# EAGLE schematic Transmitter (EAGLE 7.6.0)
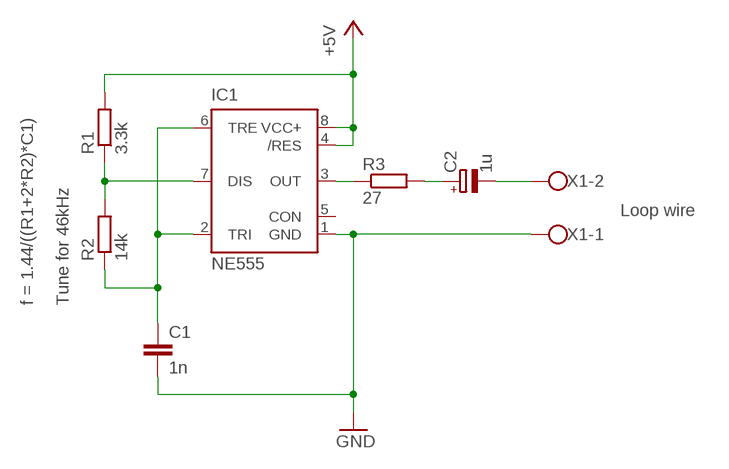
[diagram p0: schematic, sheet 1]

## Parts
C1  1n  C-EU075-032X103  [C075-032X103]
C2  1u  CPOL-EUE2.5-5  [E2,5-5]
IC1  NE555  [DIL-08]
R1  3.3k  R-EU_0204/2V  [0204V]
R2  14k  R-EU_0204/2V  [0204V]
R3  27  R-EU_0411/12  [0411/12]
X1  W237-102  [W237-102]

## Nets
+5V: IC1.4(/RES) IC1.8(VCC+) R1.2
GND: C1.2 IC1.1(GND) X1.1
N$1: C1.1 IC1.2(TRI) IC1.6(TRE) R2.1
N$2: IC1.7(DIS) R1.1 R2.2
N$5: IC1.3(OUT) R3.1
N$6: C2.+ R3.2
N$8: C2.- X1.2
Unconnected: IC1.5(CON)

## Notes on the sheet
- Loop wire
- f = 1.44/((R1+2*R2)*C1) | Tune for 46kHz

## Library data of the parts
C1 = resistor:C-EU: CAPACITOR, European symbol
C2 = resistor:CPOL-EU: POLARIZED CAPACITOR, European symbol
IC1 = st-microelectronics:NE555: General purpose bipolar Timer; MF: Arrow Electronics; MPN: NE555N; OC_FARNELL: 1467742; OC_NEWARK: 89K1486
R1-R3 = resistor:R-EU_: RESISTOR, European symbol
X1 = con-wago-500:W237-102: WAGO SCREW CLAMP; MPN: 237-102; OC_FARNELL: unknown; OC_NEWARK: 70K9898